# EAGLE design powerAMP (EAGLE 9.2.2)
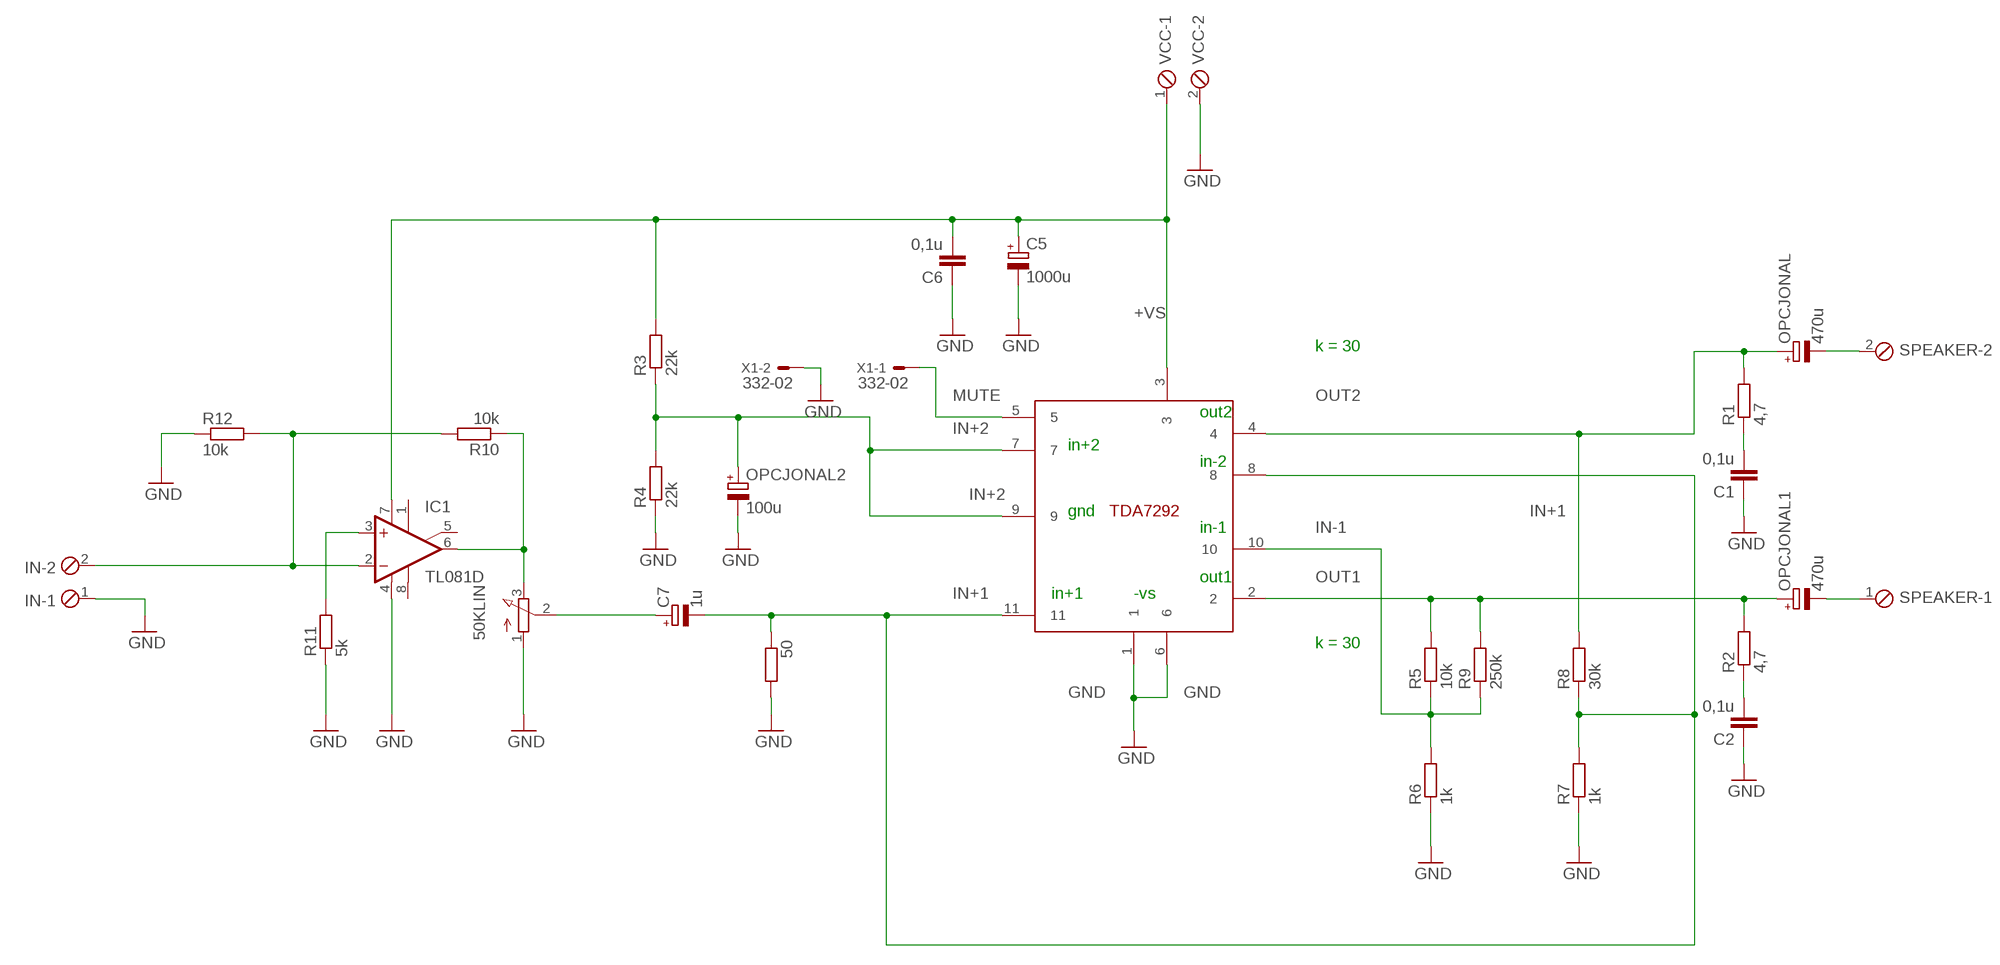
[diagram p0: schematic, sheet 1]

## Parts
50  R-EU_M0805  [M0805]
50KLIN  3RP/1610N  [3RP/1610N]
C1  0,1u  C-EUC1206  [C1206]
C2  0,1u  C-EUC1206  [C1206]
C5  1000u  CPOL-EUE2.5-7  [E2,5-7]
C6  0,1u  C-EUC1206  [C1206]
C7  1u  CPOL-EUE2.5-5  [E2,5-5]
IC1  TL081D  [SO08]
IN  MPT2  [2POL254]
OPCJONAL  470u  CPOL-EUE2.5-7  [E2,5-7]
OPCJONAL1  470u  CPOL-EUE2.5-7  [E2,5-7]
OPCJONAL2  100u  CPOL-EUE2.5-7  [E2,5-7]
R1  4,7  R-EU_M0805  [M0805]
R2  4,7  R-EU_M0805  [M0805]
R3  22k  R-EU_M0805  [M0805]
R4  22k  R-EU_M0805  [M0805]
R5  10k  R-EU_M0805  [M0805]
R6  1k  R-EU_M0805  [M0805]
R7  1k  R-EU_M0805  [M0805]
R8  30k  R-EU_M0805  [M0805]
R9  250k  R-EU_M0805  [M0805]
R10  10k  R-EU_M0805  [M0805]
R11  5k  R-EU_M0805  [M0805]
R12  10k  R-EU_M0805  [M0805]
SPEAKER  MPT2  [2POL254]
U$1  TDA7292TDA7292  [MULTIWATT11]
VCC  MPT2  [2POL254]
X1  332-02  [332-02]

## Nets
+VS: C5.+ C6.2 IC1.7(V+) R3.2 U$1.3 VCC.1
GND: 50.2 50KLIN.1(A) C1.1 C2.1 C5.- C6.1 IC1.4(V-) IN.1 OPCJONAL2.- R4.1 R6.1 R7.1 R11.1 R12.1 U$1.1 U$1.6 VCC.2 X1.2
IN+1: 50.1 C7.- R7.2 R8.1 U$1.8 U$1.11
IN+2: OPCJONAL2.+ R3.1 R4.2 U$1.7 U$1.9
IN-1: R5.1 R6.2 R9.1 U$1.10
MUTE: U$1.5 X1.1
N$1: C1.2 R1.1
N$2: 50KLIN.3(E) IC1.6(OUT) R10.1
N$3: 50KLIN.2(S) C7.+
N$4: C2.2 R2.1
N$5: IC1.2(-IN) IN.2 R10.2 R12.2
N$6: IC1.3(+IN) R11.2
OUT1: OPCJONAL1.+ R2.2 R5.2 R9.2 U$1.2
OUT2: OPCJONAL.+ R1.2 R8.2 U$1.4
SPK+: OPCJONAL1.- SPEAKER.1
SPK-: OPCJONAL.- SPEAKER.2
Unconnected: IC1.1(ON1) IC1.5(ON2) IC1.8(OPT)

## Notes on the sheet
- k = 30
- out2
- in+2
- in-2
- gnd
- in-1
- out1
- in+1 | -vs
- k = 30

## Library data of the parts
50 R1-R12 = rcl:R-EU_: RESISTOR, European symbol; SPICEPREFIX: R
50KLIN = pot:3RP/1610N: 16mm Potentiometer one level Source: http://www.alphapotentiometers.net/html/16mm_pot_2.html
C1 C2 C6 = rcl:C-EU: CAPACITOR, European symbol; SPICEPREFIX: C
C5 C7 OPCJONAL OPCJONAL1 OPCJONAL2 = rcl:CPOL-EU: POLARIZED CAPACITOR, European symbol; SPICEPREFIX: C
IC1 = linear:TL081: OP AMP
IN SPEAKER VCC = con-phoenix-254:MPT2: PHOENIX CONNECTOR; OC_FARNELL: unknown; OC_NEWARK: unknown
U$1 = TDA7292:TDA7292: Multiwatt11 package for TDA7292 / TDA7269A / TDA7265 / TDA7265B
X1 = con-garry:332-02: 2 Pin - 2mm Dual Row Source: www.mpe-connector.de / garry_shortform_2012.pdf

## Board
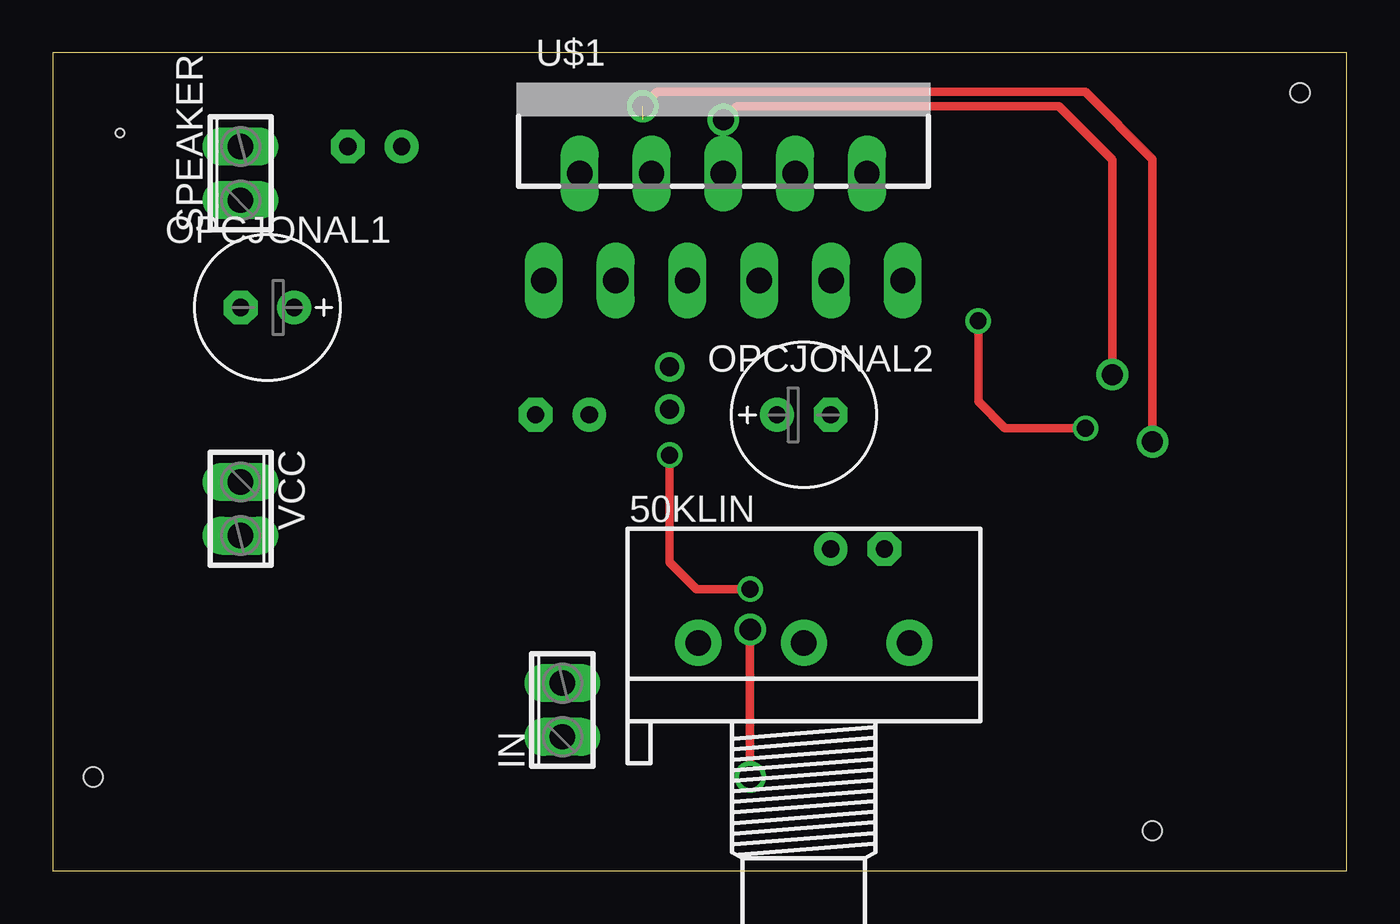
[diagram p1: board, top side]
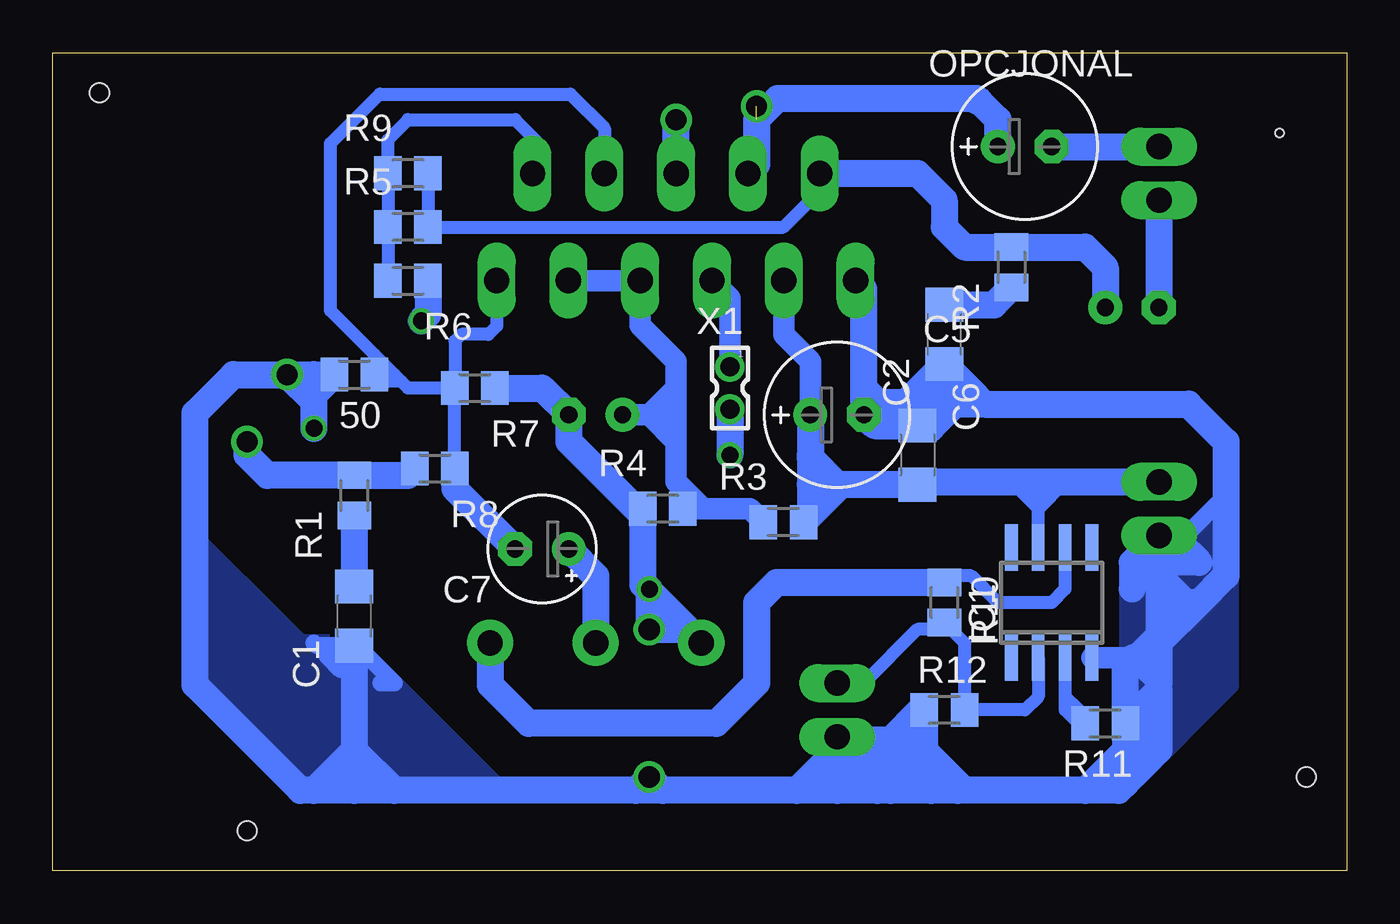
[diagram p2: board, bottom side, seen from below]

Size 61.27 x 38.73 mm. Coordinates in mm from the lower left corner, seen from the top.
Outline: 0,0 61.27,0 61.27,38.73 0,38.73 0,0
Copper layers (1*16): Top 0.035mm / dielectric 1.5mm / Bottom 0.035mm
Design rules "default": minimum track width 6mil, minimum drill 0.35mm, track to track 6mil, track to pad 6mil, pad to pad 6mil, via to via 6mil, smd to smd 6mil, copper to edge 40mil, drill to drill 6mil, minimum pad ring 10mil, minimum via ring 8mil, stop-mask expansion 4mil, vias tented up to drill 0mil, thermal gap 10mil
Holes 0.9 mm at 1.91,4.45 52.07,1.91 59.05,36.83
Holes 0.4 mm at 3.17,34.92

### Footprints (pad centres in the part's own frame; a part is rotated, then mirrored left to right if it is on the bottom)
M0805 = smd 1.3 x 1.6: 1 -0.95,0; 2 0.95,0
3RP/1610N = drill 1.2 pad 2.184: 1 -5,0; 2 0,0; 3 5,0
C1206 = smd 1.6 x 1.8: 1 -1.4,0; 2 1.4,0
E2,5-7 = drill 0.813 pad 1.6: + -1.27,0 | drill 0.813 pad 1.6 octagon: - 1.27,0
E2,5-5 = drill 0.813 pad 1.6: + -1.27,0 | drill 0.813 pad 1.6 octagon: - 1.27,0
SO08 = smd 0.6 x 2.2: 1 -1.905,-2.6; 2 -0.635,-2.6; 3 0.635,-2.6; 4 1.905,-2.6; 5 1.905,2.6; 6 0.635,2.6; 7 -0.635,2.6; 8 -1.905,2.6
2POL254 = drill 1.2 long: 1 -1.27,0; 2 1.27,0
MULTIWATT11 = drill 1.2 long: 1 -8.5,-5.08; 2 -6.8,0; 3 -5.1,-5.08; 4 -3.4,0; 5 -1.7,-5.08; 6 0,0; 7 1.7,-5.08; 8 3.4,0; 9 5.1,-5.08; 10 6.8,0; 11 8.5,-5.08
332-02 = drill 0.9 pad 1.27: 1 0,-1; 2 0,1

### Placement (x,y rotation side)
50  46.99,23.49 180 bottom
50KLIN  35.56,10.8 0 top
C1  46.99,12.07 90 bottom
C2  19.05,25.4 90 bottom
C5  24.13,21.59 0 bottom
C6  20.32,19.68 270 bottom
C7  38.1,15.24 180 bottom
IC1  13.97,12.7 0 bottom
IN  24.13,7.62 90 top
OPCJONAL  15.24,34.29 0 bottom
OPCJONAL1  10.16,26.67 180 top
OPCJONAL2  35.56,21.59 0 top
R1  46.99,17.78 90 bottom
R2  15.88,28.57 90 bottom
R3  26.67,16.51 0 bottom
R4  32.38,17.14 0 bottom
R5  44.45,30.48 0 bottom
R6  44.45,27.94 180 bottom
R7  41.27,22.86 180 bottom
R8  43.18,19.05 180 bottom
R9  44.45,33.02 0 bottom
R10  19.05,12.7 270 bottom
R11  11.43,6.99 180 bottom
R12  19.05,7.62 0 bottom
SPEAKER  8.89,33.02 90 top
U$1  31.75,33.02 0 top
VCC  8.89,17.14 270 top
X1  29.21,22.86 180 bottom

### Tracks (layer width: path | path; a pad name or v marks a point on that pad's centre or on a via)
+VS
  Bottom 0.61: IC1.7 14.61,17.14 | 14.61,17.14 13.33,18.41 | 14.61,17.14 15.88,18.41 | 14.61,17.14 14.61,18.41
  Bottom 1.016: C6.2 20.45,18.41 | C5.+ 25.4,24.13 26.65,25.38 U$1.3
  Bottom 1.27: 24.13,18.29 C6.2 20.19,18.41 15.88,18.41 14.61,18.41 13.33,18.41 VCC.1 | 24.13,18.29 25.4,18.29 | C5.+ 25.4,19.68 25.4,19.55 | 25.4,19.55 25.4,18.29 | 25.4,18.29 25.4,16.83 | 25.4,16.83 R3.2 | 24.13,18.29 24.13,18.1 25.4,16.83 | 24.13,18.29 25.4,19.55
GND  (via drill 0.8 pad 0.65, 1 pad 1.3)
  Top 0.406: v31.75,35.56 32.38,36.2 47.62,36.2 50.16,33.66 v50.16,23.49 | v29.21,19.68 29.21,14.61 30.48,13.34 v33.02,13.34 | v33.02,11.43 v33.02,4.45 | v43.81,26.04 43.81,22.22 45.09,20.95 v48.89,20.95
  Bottom 0.813: 5.71,17.78 7.94,15.56 | C1.1 46.86,10.66 45.09,8.89 45.72,8.89 | C1.1 48.77,10.66 48.89,10.8 | C1.1 47.49,10.16 48.26,10.16 47.62,9.53
  Bottom 1.016: IC1.4 10.1,10.1 | 10.1,10.1 8.89,8.89 | 10.1,10.1 8.89,11.31 8.89,11.43
  Bottom 1.27: U$1.1 22.86,27.55 22.86,22.86 | C5.- 22.86,22.86 | R7.1 38.1,22.86 OPCJONAL2.- 36.83,20.32 33.66,17.14 R4.1 33.34,13.57 33.1,13.34 | 8.89,13.97 8.89,14.61 6.98,14.61 7.94,15.56 8.26,15.88 VCC.2 10.16,14.61 10.16,13.34 | 8.89,13.97 8.89,12.7 | 8.89,12.7 8.89,11.43 8.89,10.8 | 8.89,10.8 8.89,8.89 8.89,8.57 | 8.89,8.57 8.89,7.62 | 8.89,7.62 9.53,6.99 R11.1 | 8.89,7.62 8.89,5.71 | 8.89,5.71 10.48,4.12 | 12.38,3.81 10.79,3.81 10.48,4.12 | 12.38,3.81 18.42,3.81 | 18.42,3.81 19.69,3.81 | 19.69,3.81 21.59,3.81 | 21.59,3.81 22.23,3.81 | 22.23,3.81 24.13,3.81 | 24.13,3.81 26.04,3.81 | 26.04,3.81 32.38,3.81 | 32.38,3.81 33.66,3.81 | 33.66,3.81 45.09,3.81 | 45.09,3.81 46.99,3.81 | 46.99,3.81 48.89,3.81 | 48.89,3.81 49.53,3.81 54.53,8.81 54.53,21.67 52.7,23.49 v50.16,23.49 | U$1.6 v31.75,35.56 31.75,35.17 | 8.89,5.71 9.21,5.71 R11.1 | R11.1 8.89,8.57 | 20,6.99 R12.1 20.16,7.62 21.59,6.19 | 20,6.99 20,5.71 | 20,5.71 20,4.12 19.69,3.81 | 20,5.71 18.42,4.13 18.42,3.81 | 20.64,5.08 21.59,4.12 21.59,3.81 | 24.13,5.71 22.23,3.81 | IN.1 24.13,5.08 | 24.13,5.08 24.13,3.81 | IN.1 24.13,5.71 | 24.13,5.71 26.04,3.81 | C1.1 46.99,5.71 | 46.99,5.71 46.99,3.81 | 46.99,5.71 45.09,3.81 | 46.99,5.71 48.89,3.81 | C6.1 20.32,22.73 | 20.32,22.73 C2.1 17.85,22.79 | 17.85,22.79 17.15,22.09 | 17.15,22.09 7.49,22.09 5.71,20.32 5.71,17.78 5.71,13.97 6.98,12.7 | 7.62,12.7 8.89,12.7 | 6.98,12.7 7.62,12.7 | 7.62,12.7 8.89,13.97 | 6.98,12.7 8.89,10.8 | R11.1 10.48,9.72 10.1,10.1 | R11.1 10.48,5.71 | 10.48,5.71 10.48,4.12 | 10.48,5.71 12.38,3.81 | 20,5.71 20.64,5.08 | 20.64,5.08 21.91,5.08 | 21.91,5.08 24.13,5.08 | 20,6.99 20.8,6.19 | 20.8,6.19 21.91,5.08 | 20.8,6.19 21.59,6.19 | 21.59,6.19 23.97,6.19 IN.1
  Bottom 1.27: v50.16,23.49 48.89,23.49 | 48.89,23.49 48.08,23.49 | C5.- 22.36,21.09 21.59,21.09 | 21.59,21.09 C6.1 | 17.15,22.09 18.55,22.09 | 18.55,22.09 19.69,22.09 20.32,22.73 | 17.85,22.79 18.99,22.79 19.05,22.86 | 18.55,22.09 19.69,20.95 20.19,20.95 C6.1 | 20.32,22.73 20.89,22.16 | 20.89,22.16 21.59,21.46 21.59,21.09 | 20.89,22.16 22.29,22.16 | 22.29,22.16 C5.- | 22.29,22.16 22.29,22.29 22.86,22.86 | 33.02,13.25 50KLIN.1 31.2,11.43 v33.02,11.43 33.02,13.25 | v33.02,13.34 33.1,13.34 | X1.2 v29.21,19.68 | R6.1 43.5,26.35 v43.81,26.04 | v48.89,20.95 48.89,22.22 | 48.89,22.54 48.89,23.49 | 48.89,22.22 48.89,22.54 | 48.89,22.54 50.2 | 48.89,22.22 v50.16,23.49 | 32.38,3.81 v33.02,4.45 33.66,3.81 | 33.02,13.25 33.1,13.34
  pour Bottom: 5.71,15.88 8.89,15.88 10.16,14.61 10.16,4.45 5.71,8.89 5.71,13.97
  pour Bottom: 40,3.81 46.99,10.8 49.53,10.8 50.16,11.43 54.61,15.88 54.61,8.89 49.53,3.81
IN+1
  Bottom 0.61: U$1.8 35.15,35.15 36.77,36.77 45.78,36.77 48.13,34.42 48.13,26.54 46.04,24.45 | U$1.11 40.25,25.79 40.64,25.4 41.91,25.4 42.23,25.09 R7.2 | 45.09,23.49 45.72,23.49 | 45.72,23.49 50.1 | 46.35,23.49 50.1 | 46.04,24.45 50.1 | 46.04,24.45 45.09,23.49 | R8.1 R7.2 | R7.2 44.45,22.86 44.77,23.18 | 44.77,23.18 45.09,23.49 | 44.77,23.18 45.4,23.18 45.72,23.49
  Bottom 1.27: R8.1 42.23,18.1 C7.-
IN+2
  Bottom 1.016: U$1.9 U$1.7 33.45,25.83 31.75,24.13 31.75,22.86 | 31.75,22.86 31.75,21.59 | 31.75,21.59 31.75,20.32 | R3.1 28.26,17.14 29.85,17.14 30.48,17.14 | OPCJONAL2.+ 33.02,21.59 | 33.02,21.59 31.75,21.59 | 33.02,21.59 31.75,22.86 | 33.02,21.59 31.75,20.32 | 31.75,20.32 31.75,18.41 31.12,17.78 | 31.12,17.78 31.12,17.46 R4.2 30.48,17.14 | 30.48,17.14 31.12,17.78
IN-1
  Bottom 0.61: R6.2 R5.1 R9.1 45.4,34.61 44.45,35.56 39.37,35.56 38.1,34.29 38.55,33.84 U$1.10
MUTE
  Bottom 1.016: U$1.5 29.21,27.1 X1.1
N$1
  Bottom 1.27: R1.1 C1.2
N$2
  Bottom 0.61: 19.37,13.97 R10.1 19.05,13.97 17.78,13.97 16.51,12.7 13.97,12.7 13.33,13.34 IC1.6 | 21.91,13.65 22.23,13.34
  Bottom 1.27: 50KLIN.3 40.56,8.81 38.73,6.99 29.85,6.99 27.94,8.89 27.94,12.7 26.99,13.65 21.91,13.65 R10.1
N$3
  Bottom 1.27: C7.+ 35.56,13.97 50KLIN.2
N$4
  Bottom 1.27: C2.2 16.7,26.8 R2.1
N$5
  Bottom 0.61: R10.2 18.73,11.43 | R10.2 18.1,10.8 R12.2 15.24,7.62 14.61,8.25 IC1.2 | R10.2 19.37,11.43 20.32,11.43 22.86,8.89 IN.2
N$6
  Bottom 0.61: IC1.3 13.33,8.25 | 13.33,8.25 13.33,7.62 12.7,6.99 R11.2 | 13.33,8.25 12.7,7.62
OUT1
  Bottom 0.61: R9.2 R5.2 26.67,30.48 25.4,31.75 25.4,32.57 U$1.2
  Bottom 1.27: U$1.2 20.32,33.02 19.05,31.75 19.05,30.48 18.1,29.52 R2.2 12.38,29.52 11.43,28.57 OPCJONAL1.+
OUT2  (via drill 1 pad 1.3)  (1 unrouted)
  Top 0.406: v27.94,36.2 28.62,36.87 48.89,36.87 52.07,33.7 v52.07,20.32
  Bottom 1.27: OPCJONAL.+ 16.51,35.56 17.39,36.44 | 17.39,36.44 17.52,36.44 | U$1.4 27.94,33.43 27.94,35.56 26.93,36.57 17.52,36.57 17.39,36.44 | R8.2 44.45,18.73 R1.2 51.11,18.73 52.07,19.68 v52.07,20.32
SPK+
  Bottom 1.27: SPEAKER.1 OPCJONAL1.-
SPK-
  Bottom 1.27: OPCJONAL.- SPEAKER.2